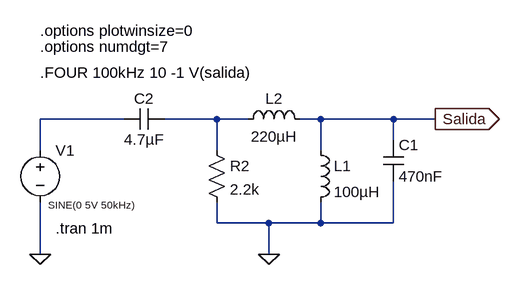
[diagram p0: schematic E3-RLC-options.asc]
E3-RLC-options.asc, the LTspice schematic file:
Version 4
SHEET 1 880 680
WIRE -224 -192 -352 -192
WIRE -80 -192 -160 -192
WIRE -32 -192 -80 -192
WIRE 80 -192 48 -192
WIRE 192 -192 80 -192
WIRE 256 -192 192 -192
WIRE 192 -160 192 -192
WIRE -352 -144 -352 -192
WIRE -80 -144 -80 -192
WIRE 80 -144 80 -192
WIRE -80 -32 -80 -64
WIRE 0 -32 -80 -32
WIRE 80 -32 80 -64
WIRE 80 -32 0 -32
WIRE 192 -32 192 -96
WIRE 192 -32 80 -32
WIRE -352 16 -352 -64
WIRE 0 16 0 -32
FLAG -352 16 0
FLAG 0 16 0
FLAG 256 -192 Salida
IOPIN 256 -192 Out
SYMBOL voltage -352 -160 R0
WINDOW 3 12 100 Left 1
WINDOW 123 0 0 Left 0
WINDOW 39 0 0 Left 0
SYMATTR Value SINE(0 5V 50kHz)
SYMATTR InstName V1
SYMBOL cap 176 -160 R0
SYMATTR InstName C1
SYMATTR Value 470nF
SYMBOL ind 64 -160 R0
SYMATTR InstName L1
SYMATTR Value 100µH
SYMBOL cap -160 -208 R90
WINDOW 0 0 32 VBottom 2
WINDOW 3 32 32 VTop 2
SYMATTR InstName C2
SYMATTR Value 4.7µF
SYMBOL ind -48 -176 R270
WINDOW 0 32 56 VTop 2
WINDOW 3 5 56 VBottom 2
SYMATTR InstName L2
SYMATTR Value 220µH
SYMBOL res -96 -160 R0
SYMATTR InstName R2
SYMATTR Value 2.2k
TEXT -328 -24 Left 2 !.tran 1m
TEXT -352 -328 Left 2 !.options plotwinsize=0
TEXT -352 -304 Left 2 !.options numdgt=7
TEXT -352 -264 Left 2 !.FOUR 100kHz 10 -1 V(salida)

The netlist it stands for:
* E3-RLC-options.asc
V1 N001 0 SINE(0 5V 50kHz)
C1 Salida 0 470nF
L1 Salida 0 100µH
C2 N002 N001 4.7µF
L2 N002 Salida 220µH
R2 N002 0 2.2k
.tran 1m
.options plotwinsize=0
.options numdgt=7
.FOUR 100kHz 10 -1 V(salida)
.backanno
.end